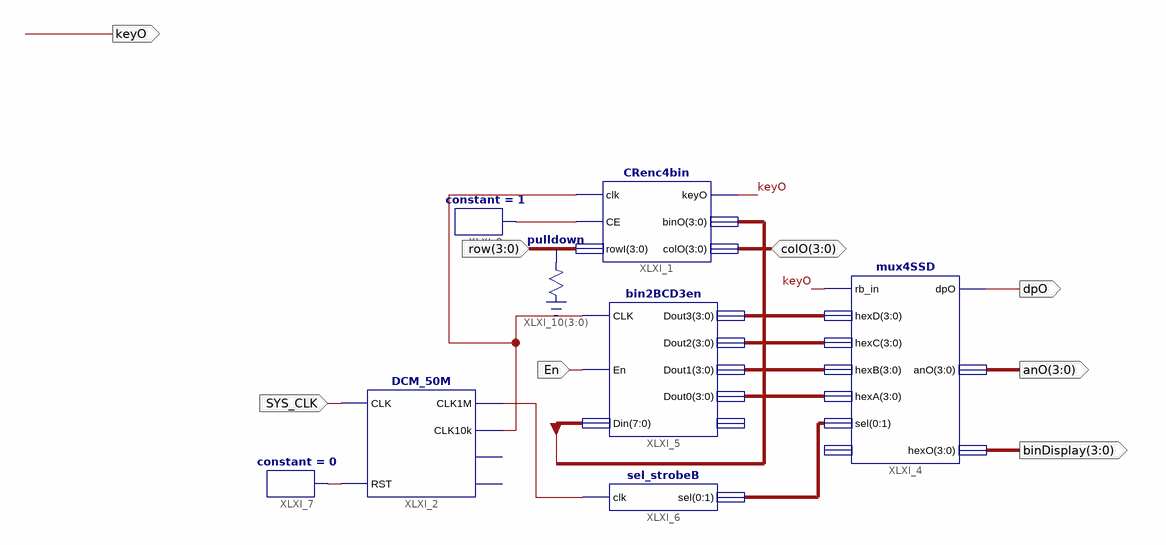
[diagram p0: schematic sheet 1]
// Xilinx ISE schematic Decoder.sch (spartan3e) as structural Verilog: 8 symbols, 8 ports
module Decoder (
  input  SYS_CLK,
  input  En,
  input  [3:0] row,
  inout  [3:0] colO,
  output keyO,
  output [3:0] binDisplay,
  output [3:0] anO,
  output dpO
);

  wire XLXN_4, XLXN_5, XLXN_6, XLXN_7;
  wire [1:0] XLXN_14;
  wire [3:0] XLXN_9, XLXN_10, XLXN_11, XLXN_13;
  wire [7:0] binO;

  DCM_50M XLXI_2 (.CLK(SYS_CLK), .RST(XLXN_7), .CLK1M(XLXN_6), .CLK10k(XLXN_5));  // open: CLK1k, CLK1
  sel_strobeB XLXI_6 (.clk(XLXN_6), .sel({XLXN_14[0], XLXN_14[1]}));
  constant #(.CValue("0")) XLXI_7 (.O(XLXN_7));
  mux4SSD XLXI_4 (
    .rb_in(keyO), .hexD(XLXN_9), .hexC(XLXN_10), .hexB(XLXN_11), .hexA(XLXN_13),
    .sel({XLXN_14[0], XLXN_14[1]}), .dpO(dpO), .anO(anO), .hexO(binDisplay));  // open: dp_in
  bin2BCD3en XLXI_5 (
    .CLK(XLXN_5), .En(En), .Din(binO), .Dout3(XLXN_9), .Dout2(XLXN_10), .Dout1(XLXN_11), .Dout0(XLXN_13));  // open: RBout
  constant #(.CValue("1")) XLXI_8 (.O(XLXN_4));
  CRenc4bin XLXI_1 (.clk(XLXN_5), .CE(XLXN_4), .rowI(row), .keyO(keyO), .binO(binO[3:0]), .colO(colO));
  \pulldown  XLXI_10[3:0] (.O(row));
endmodule
